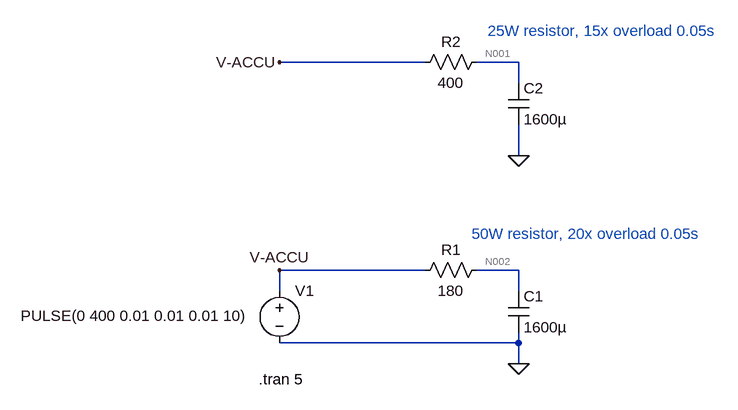
[diagram p0: schematic precharge_400V_1600uF.asc]
precharge_400V_1600uF.asc, the LTspice schematic file:
Version 4
SHEET 1 880 680
WIRE 128 -224 -96 -224
WIRE 272 -224 208 -224
WIRE 272 -192 272 -224
WIRE 272 -80 272 -128
WIRE 128 96 -96 96
WIRE 272 96 208 96
WIRE -96 128 -96 96
WIRE 272 128 272 96
WIRE 272 208 272 192
WIRE 272 208 -96 208
WIRE 272 240 272 208
FLAG 272 240 0
FLAG 272 -80 0
FLAG -96 96 V-ACCU
FLAG -96 -224 V-ACCU
SYMBOL res 224 80 R90
WINDOW 0 0 56 VBottom 2
WINDOW 3 32 56 VTop 2
SYMATTR InstName R1
SYMATTR Value 180
SYMBOL cap 256 128 R0
SYMATTR InstName C1
SYMATTR Value 1600µ
SYMBOL voltage -96 112 R0
WINDOW 3 -398 54 Left 2
WINDOW 123 0 0 Left 0
WINDOW 39 0 0 Left 0
SYMATTR Value PULSE(0 400 0.01 0.01 0.01 10)
SYMATTR InstName V1
SYMBOL res 224 -240 R90
WINDOW 0 0 56 VBottom 2
WINDOW 3 32 56 VTop 2
SYMATTR InstName R2
SYMATTR Value 400
SYMBOL cap 256 -192 R0
SYMATTR InstName C2
SYMATTR Value 1600µ
TEXT -128 264 Left 2 !.tran 5
TEXT 200 40 Left 2 ;50W resistor, 20x overload 0.05s
TEXT 224 -272 Left 2 ;25W resistor, 15x overload 0.05s

The netlist it stands for:
* precharge_400V_1600uF.asc
R1 N002 V-ACCU 180
C1 N002 0 1600µ
V1 V-ACCU 0 PULSE(0 400 0.01 0.01 0.01 10)
R2 N001 V-ACCU 400
C2 N001 0 1600µ
.tran 5
* 50W resistor, 20x overload 0.05s
* 25W resistor, 15x overload 0.05s
.backanno
.end

* Results of the author's LTspice run, read from the files saved beside the schematic
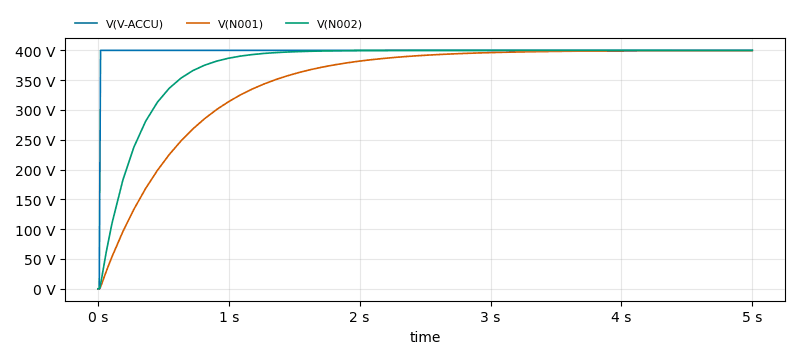
[diagram p1: Transient Analysis of precharge_400V_1600uF.asc, plotted from the saved traces]
* Transient Analysis, 1 run:
*   V(V-ACCU): min 0 V, max 400 V, average 398.8 V, rms 399.3 V, last 400 V
*   V(N001): min 0 V, max 399.8 V, average 347.5 V, rms 358.9 V, last 399.8 V
*   V(N002): min 0 V, max 400 V, average 375.6 V, rms 381.7 V, last 400 V